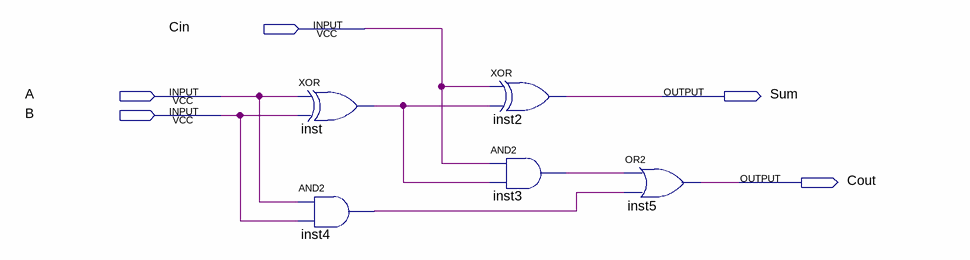
[diagram p0: schematic sheet]
// Quartus schematic FullAdder.bdf as structural Verilog: 5 symbols, 5 pins
module FullAdder (
  input  Cin,
  input  A,
  input  B,
  output Sum,
  output Cout
);

  wire inst3_out, inst4_out, inst_out;

  xor inst (inst_out, A, B);
  and inst4 (inst4_out, A, B);
  xor inst2 (Sum, Cin, inst_out);
  and inst3 (inst3_out, Cin, inst_out);
  or inst5 (Cout, inst3_out, inst4_out);
endmodule
